# Altium schematic sheet PIC32.SchDoc
size A2; SheetNumber: 2; SheetTotal: 6
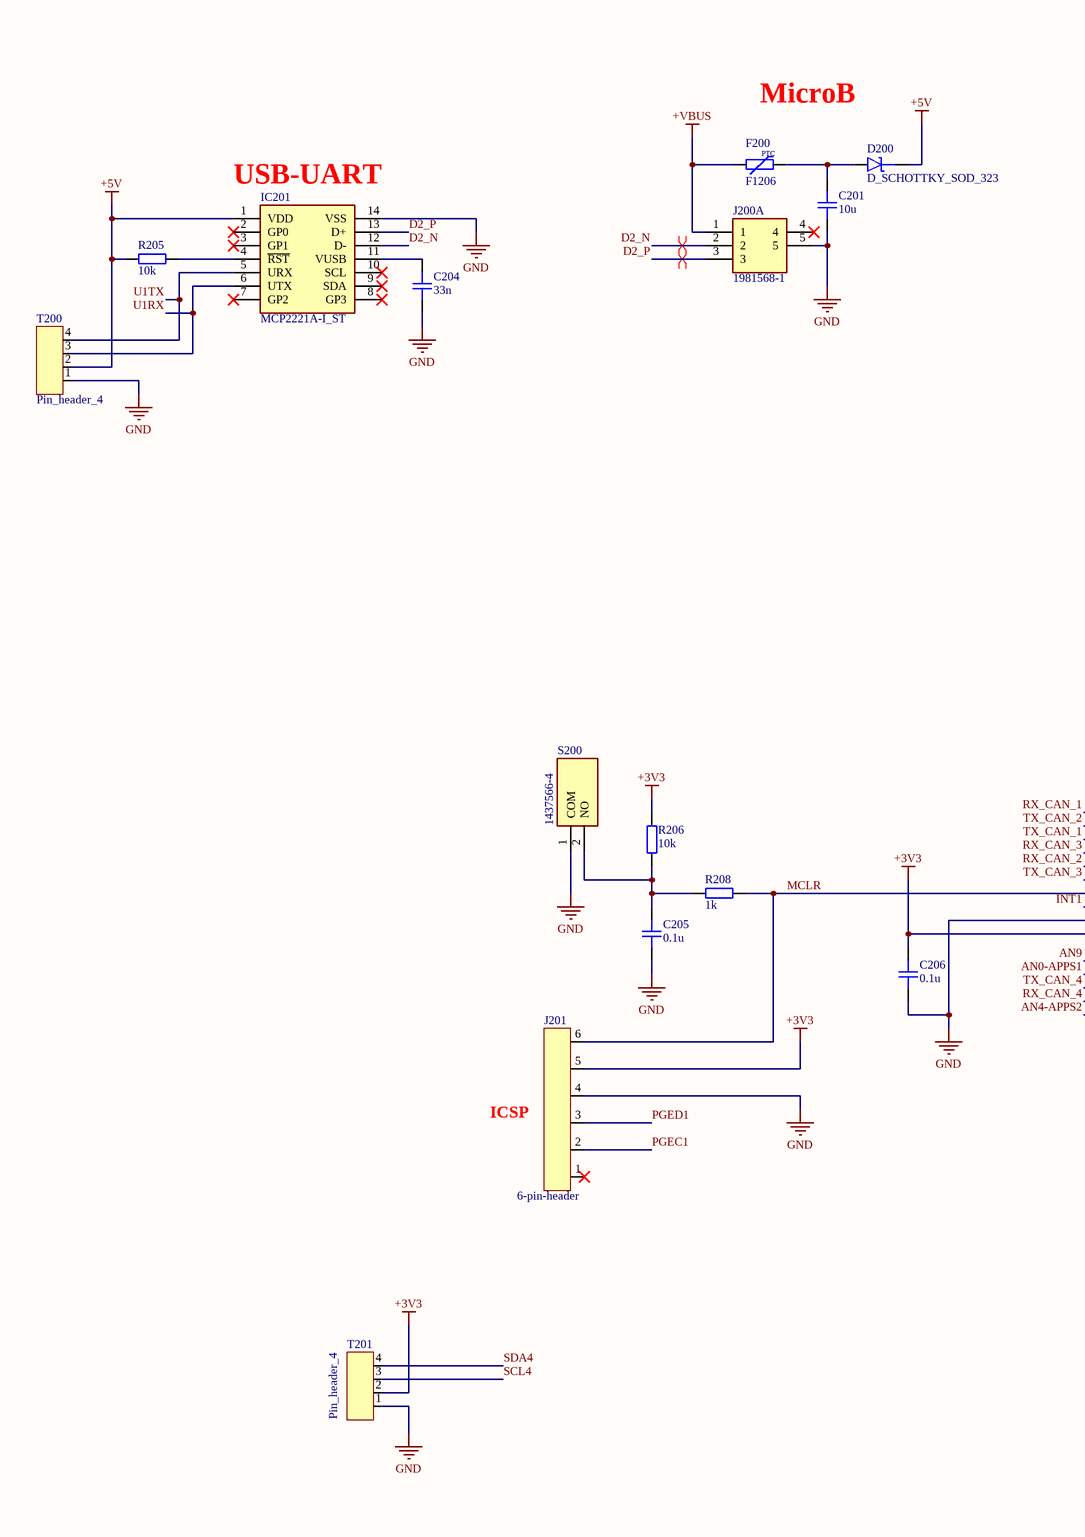
[diagram p0: PIC32.SchDoc, left]
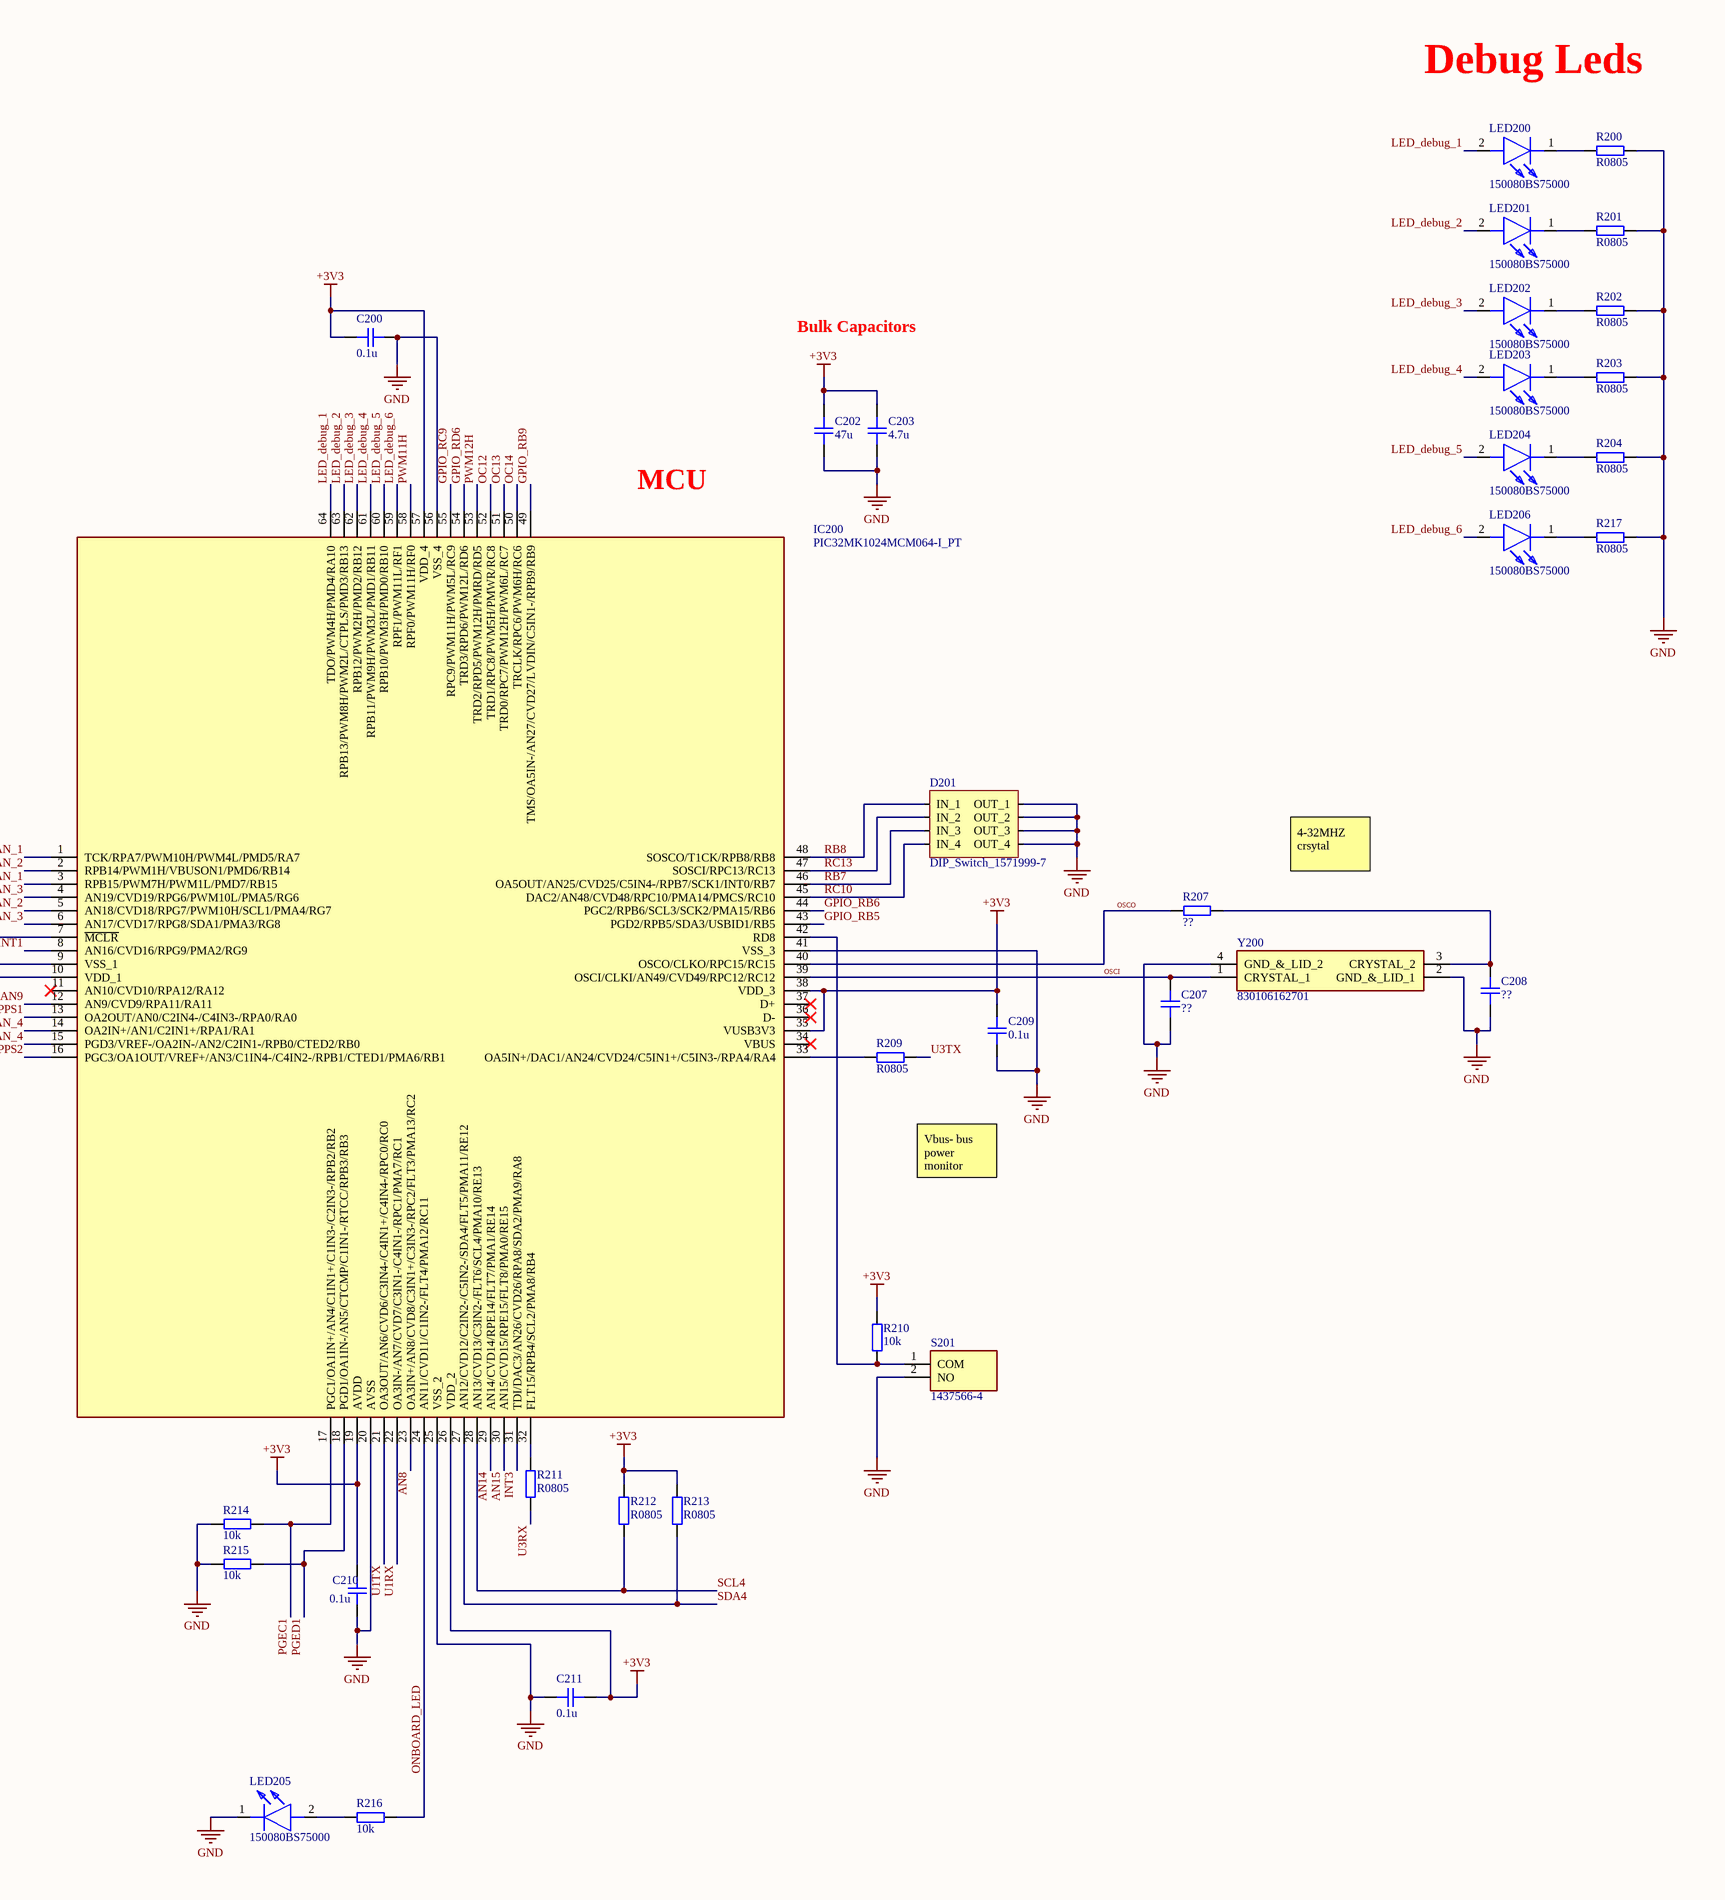
[diagram p1: PIC32.SchDoc, right]

## Parts
C200  0.1u  [CAP_0805]
C201  10u  [CAP_0805]
C202  47u  [CAP_0805]
C203  4.7u  [CAP_0805]
C204  33n  [CAP_0805]
C205  0.1u  [CAP_0805]
C206  0.1u  [CAP_0805]
C207  ??  [CAP_0805]
C208  ??  [CAP_0805]
C209  0.1u  [CAP_0805]
C210  0.1u  [CAP_0805]
C211  0.1u  [CAP_0805]
D200  D_SCHOTTKY_SOD_323  [SOD-323]
D201  DIP_Switch_1571999-7  [DIP_Switch_1571999-7 - duplicate]
F200  F1206  [FUSE_1206]
IC200  PIC32MK1024MCM064-I_PT  [QFP50P1200X1200X120-64N]
IC201  MCP2221A-I_ST  [SOP65P640X120-14N]
J200  1981568-1  [1981568-1]  (part A of 4)
J201  6-pin-header  [G800W302018EU]
LED200  150080BS75000  [LEDC2012X80N]
LED201  150080BS75000  [LEDC2012X80N]
LED202  150080BS75000  [LEDC2012X80N]
LED203  150080BS75000  [LEDC2012X80N]
LED204  150080BS75000  [LEDC2012X80N]
LED205  150080BS75000  [LEDC2012X80N]
LED206  150080BS75000  [LEDC2012X80N]
R200  R0805  [RES_0805]
R201  R0805  [RES_0805]
R202  R0805  [RES_0805]
R203  R0805  [RES_0805]
R204  R0805  [RES_0805]
R205  10k  [RES_0805]
R206  10k  [RES_0805]
R207  ??  [RES_0805]
R208  1k  [RES_0805]
R209  R0805  [RES_0805]
R210  10k  [RES_0805]
R211  R0805  [RES_0805]
R212  R0805  [RES_0805]
R213  R0805  [RES_0805]
R214  10k  [RES_0805]
R215  10k  [RES_0805]
R216  10k  [RES_0805]
R217  R0805  [RES_0805]
S200  1437566-4  [14375664]
S201  1437566-4  [14375664]
T200  Pin_header_4  [Pin_header_4]
T201  Pin_header_4  [Pin_header_4]
Y200  830106162701  [830106162701]

## Nets
+3V3: C200.1 C202.1 C203.1 C206.2 C209.1 C210.2 C211.1 IC200.10(VDD_1) IC200.19(AVDD) IC200.26(VDD_2) IC200.35(VUSB3V3) IC200.38(VDD_3) IC200.57(VDD_4) J201.5 R206.1 R210.2 R212.1 R213.1 T201.2
+5V: D200.K IC201.1(VDD) R205.1 T200.2
+VBUS: F200.1 J200.1
GND: C200.2 C201.2 C202.2 C203.2 C204.1 C205.1 C206.1 C207.1 C208.1 C209.2 C210.1 C211.2 D201.5(OUT_4) D201.6(OUT_3) D201.7(OUT_2) D201.8(OUT_1) IC200.9(VSS_1) IC200.20(AVSS) IC200.25(VSS_2) IC200.41(VSS_3) IC200.56(VSS_4) IC201.14(VSS) J200.5 J201.4 LED205.1(K) R200.1 R201.1 R202.1 R203.1 R204.1 R214.2 R215.2 R217.1 S200.1(COM) S201.2(NO) T200.1 T201.1 Y200.2(GND_&_LID_1) Y200.4(GND_&_LID_2)
AN0-APPS1: IC200.13(OA2OUT/AN0/C2IN4-/C4IN3-/RPA0/RA0)
AN4-APPS2: IC200.16(PGC3/OA1OUT/VREF+/AN3/C1IN4-/C4IN2-/RPB1/CTED1/PMA6/RB1)
AN8: IC200.23(OA3IN+/AN8/CVD8/C3IN1+/C3IN3-/RPC2/FLT3/PMA13/RC2)
AN9: IC200.12(AN9/CVD9/RPA11/RA11)
AN14: IC200.29(AN14/CVD14/RPE14/FLT7/PMA1/RE14)
AN15: IC200.30(AN15/CVD15/RPE15/FLT8/PMA0/RE15)
D2_N: IC201.12(D-) J200.2
D2_P: IC201.13(D+) J200.3
GPIO_RB5: IC200.43(PGD2/RPB5/SDA3/USBID1/RB5)
GPIO_RB6: IC200.44(PGC2/RPB6/SCL3/SCK2/PMA15/RB6)
GPIO_RB9: IC200.49(TMS/OA5IN-/AN27/CVD27/LVDIN/C5IN1-/RPB9/RB9)
GPIO_RC9: IC200.55(RPC9/PWM11H/PWM5L/RC9)
GPIO_RD6: IC200.54(TRD3/RPD6/PWM12L/RD6)
INT1: IC200.8(AN16/CVD16/RPG9/PMA2/RG9)
INT3: IC200.31(TDI/DAC3/AN26/CVD26/RPA8/SDA2/PMA9/RA8)
LED_debug_1: IC200.64(TDO/PWM4H/PMD4/RA10) LED200.2(A)
LED_debug_2: IC200.63(RPB13/PWM8H/PWM2L/CTPLS/PMD3/RB13) LED201.2(A)
LED_debug_3: IC200.62(RPB12/PWM2H/PMD2/RB12) LED202.2(A)
LED_debug_4: IC200.61(RPB11/PWM9H/PWM3L/PMD1/RB11) LED203.2(A)
LED_debug_5: IC200.60(RPB10/PWM3H/PMD0/RB10) LED204.2(A)
LED_debug_6: IC200.59(RPF1/PWM11L/RF1) LED206.2(A)
MCLR: IC200.7(~{MCLR}) J201.6 R208.1
OC12: IC200.52(TRD1/RPC8/PWM5H/PMWR/RC8)
OC13: IC200.51(TRD0/RPC7/PWM12H/PWM6L/RC7)
OC14: IC200.50(TRCLK/RPC6/PWM6H/RC6)
ONBOARD_LED: IC200.24(AN11/CVD11/C1IN2-/FLT4/PMA12/RC11) R216.1
OSCI: C207.2 IC200.39(OSCI/CLKI/AN49/CVD49/RPC12/RC12) Y200.1(CRYSTAL_1)
OSCO: IC200.40(OSCO/CLKO/RPC15/RC15) R207.2
PGEC1: IC200.17(PGC1/OA1IN+/AN4/C1IN1+/C1IN3-/C2IN3-/RPB2/RB2) J201.2 R214.1
PGED1: IC200.18(PGD1/OA1IN-/AN5/CTCMP/C1IN1-/RTCC/RPB3/RB3) J201.3 R215.1
PWM11H: IC200.58(RPF0/PWM11H/RF0)
PWM12H: IC200.53(TRD2/RPD5/PWM12H/PMRD/RD5)
RB7: D201.3(IN_3) IC200.46(OA5OUT/AN25/CVD25/C5IN4-/RPB7/SCK1/INT0/RB7)
RB8: D201.1(IN_1) IC200.48(SOSCO/T1CK/RPB8/RB8)
RC10: D201.4(IN_4) IC200.45(DAC2/AN48/CVD48/RPC10/PMA14/PMCS/RC10)
RC13: D201.2(IN_2) IC200.47(SOSCI/RPC13/RC13)
RX_CAN_1: IC200.1(TCK/RPA7/PWM10H/PWM4L/PMD5/RA7)
RX_CAN_2: IC200.5(AN18/CVD18/RPG7/PWM10H/SCL1/PMA4/RG7)
RX_CAN_3: IC200.4(AN19/CVD19/RPG6/PWM10L/PMA5/RG6)
RX_CAN_4: IC200.15(PGD3/VREF-/OA2IN-/AN2/C2IN1-/RPB0/CTED2/RB0)
SCL4: IC200.28(AN13/CVD13/C3IN2-/FLT6/SCL4/PMA10/RE13) R212.2 T201.3
SDA4: IC200.27(AN12/CVD12/C2IN2-/C5IN2-/SDA4/FLT5/PMA11/RE12) R213.2 T201.4
TX_CAN_1: IC200.3(RPB15/PWM7H/PWM1L/PMD7/RB15)
TX_CAN_2: IC200.2(RPB14/PWM1H/VBUSON1/PMD6/RB14)
TX_CAN_3: IC200.6(AN17/CVD17/RPG8/SDA1/PMA3/RG8)
TX_CAN_4: IC200.14(OA2IN+/AN1/C2IN1+/RPA1/RA1)
U1RX: IC200.22(OA3IN-/AN7/CVD7/C3IN1-/C4IN1-/RPC1/PMA7/RC1) IC201.6(UTX) T200.3
U1TX: IC200.21(OA3OUT/AN6/CVD6/C3IN4-/C4IN1+/C4IN4-/RPC0/RC0) IC201.5(URX) T200.4
U3RX: R211.2
U3TX: R209.2
NetC201_1: C201.1 D200.A F200.2
NetC204_2: C204.2 IC201.11(VUSB)
NetC205_2: C205.2 R206.2 R208.2 S200.2(NO)
NetC208_2: C208.2 R207.1 Y200.3(CRYSTAL_2)
NetIC200_32: IC200.32(FLT15/RPB4/SCL2/PMA8/RB4) R211.1
NetIC200_33: IC200.33(OA5IN+/DAC1/AN24/CVD24/C5IN1+/C5IN3-/RPA4/RA4) R209.1
NetIC200_42: IC200.42(RD8) R210.1 S201.1(COM)
NetIC201_4: IC201.4(~{RST}) R205.2
NetLED200_1: LED200.1(K) R200.2
NetLED201_1: LED201.1(K) R201.2
NetLED202_1: LED202.1(K) R202.2
NetLED203_1: LED203.1(K) R203.2
NetLED204_1: LED204.1(K) R204.2
NetLED205_2: LED205.2(A) R216.2
NetLED206_1: LED206.1(K) R217.2

Not connected (* = marked no-connect by the designer): IC200 11(AN10/CVD10/RPA12/RA12)* 34(VBUS)* 36(D-)* 37(D+)*; IC201 2(GP0)* 3(GP1)* 7(GP2)* 8(GP3)* 9(SDA)* 10(SCL)*; J200 4*; J201 1*

## Layout directives
differential pair; net class DIFF_USB: D2_N, D2_P

## Notes on the sheet
- Debug Leds
- MicroB
- (near IC201) USB-UART
- Bulk Capacitors
- (near IC200) MCU
- 4-32MHZ crsytal
- (near J201) ICSP
- Vbus- bus power monitor
- (in symbol FUSE_PPTC_1206) PTC

## Library data of the parts
C200 C202 C203 C205-C211 = CAP_0805_16V: Capacitor SMD 0805 16V
C201 C204 = CAP_0805_10V: Capacitor SMD 0805 10V
D200 = D_SCHOTTKY_SOD_323: Diode Schottky SMD SOD-323
F200 = FUSE_PPTC_1206: Fuse PPTC SMD 1206; Manufacturer: *; Manufacturer Part Number: *
IC200 = PIC32MK1024MCM064-I_PT: Integrated Circuit; Manufacturer_Name: Microchip; Manufacturer_Part_Number: PIC32MK1024MCM064-I/PT; Datasheet Link: https://ww1.microchip.com/downloads/aemDocuments/documents/MCU32/ProductDocuments/DataSheets/PIC32MK-GPK-MCM-with-CAN-FD-Family-DataSheet-DS60001519E.pdf; Height: 1.2mm; Mouser Part Number: 579-2MK1024MCM064IPT; Mouser Price/Stock: https://www.mouser.co.uk/ProductDetail/Microchip-Technology/PIC32MK1024MCM064-I-PT?qs=W%2FMpXkg%252BdQ4dBI32NJdQMg%3D%3D; Arrow Part Number: PIC32MK1024MCM064-I/PT; Arrow Price/Stock: https://www.arrow.com/en/products/pic32mk1024mcm064-ipt/microchip-technology?region=nac
IC201 = MCP2221A-I_ST: Integrated Circuit; Manufacturer_Name: Microchip; Manufacturer_Part_Number: MCP2221A-I/ST; Datasheet Link: http://ww1.microchip.com/downloads/en/devicedoc/20005565b.pdf; Height: 1.2mm; Mouser Part Number: 579-MCP2221A-I/ST; Mouser Price/Stock: https://www.mouser.co.uk/ProductDetail/Microchip-Technology/MCP2221A-I-ST?qs=ZEMkBHnybREMkqMgzOrcGQ%3D%3D; Arrow Part Number: MCP2221A-I/ST; Arrow Price/Stock: https://www.arrow.com/en/products/mcp2221a-ist/microchip-technology?region=nac
J200 = 1981568-1: Connector; Manufacturer_Name: TE Connectivity; Datasheet Link: http://www.te.com/commerce/DocumentDelivery/DDEController?Action=srchrtrv&DocNm=1981568&DocType=Customer+Drawing&DocLang=English; Manufacturer_Part_Number: 1981568-1; Mouser Part Number: 571-1981568-1; Mouser Price/Stock: https://www.mouser.co.uk/ProductDetail/TE-Connectivity/1981568-1?qs=zxTme0yW%2FbaAfvOKTKC5hw%3D%3D; Arrow Part Number: 1981568-1; Arrow Price/Stock: https://www.arrow.com/en/products/1981568-1/te-connectivity?region=europe
J201 = G800W302018EU: Pin Header 6 Position 2.54mm Pitch; Manufacturer: Amphenol; Manufacturer Part Number: G800W302018EU
LED200-LED206 = 150080BS75000: LED; Manufacturer_Name: Wurth Elektronik; Datasheet Link: https://katalog.we-online.com/led/datasheet/150080BS75000.pdf; Height: 0.8mm; Manufacturer_Part_Number: 150080BS75000; Mouser Part Number: 710-150080BS75000; Mouser Price/Stock: https://www.mouser.co.uk/ProductDetail/Wurth-Elektronik/150080BS75000?qs=2kOmHSv6VfT2tBo3UPVqAQ%3D%3D
R200-R217 = RES_0805: Resistor SMD 0805
  R200-R204 R209 R211-R213 R217: Manufacturer: *; Manufacturer Part Number: *; Distributor Link: *; LCSC: *
S200 S201 = 1437566-4: Switch; Manufacturer_Name: TE Connectivity; Datasheet Link: https://www.te.com/commerce/DocumentDelivery/DDEController?Action=showdoc&DocId=Customer+Drawing%7F1437566-3%7FC2%7Fpdf%7FEnglish%7FENG_CD_1437566-3_C7F14375662_1437566_3_1_c.dwg.pdf%-4; Height: 4.87mm; Manufacturer_Part_Number: 1437566-4; Mouser Part Number: N/A; Mouser Price/Stock: https://www.mouser.co.uk/ProductDetail/TE-Connectivity-Alcoswitch/1437566-4?qs=xoXDFGdkQ2nbcMrTmW1sHA%3D%3D; Arrow Part Number: 1437566-4; Arrow Price/Stock: https://www.arrow.com/en/products/1437566-4/te-connectivity?region=europe
Y200 = 830106162701: Crystal or Oscillator; Manufacturer_Name: Wurth Elektronik; Datasheet Link: https://www.we-online.com/components/products/datasheet/830106162701.pdf; Height: 1mm; Manufacturer_Part_Number: 830106162701; Mouser Part Number: 710-830106162701; Mouser Price/Stock: https://www.mouser.co.uk/ProductDetail/Wurth-Elektronik/830106162701?qs=hd1VzrDQEGiB2nVeND4SIw%3D%3D